# EAGLE design USB_LiPolyCharger_SingleCell (EAGLE 6.5.0)
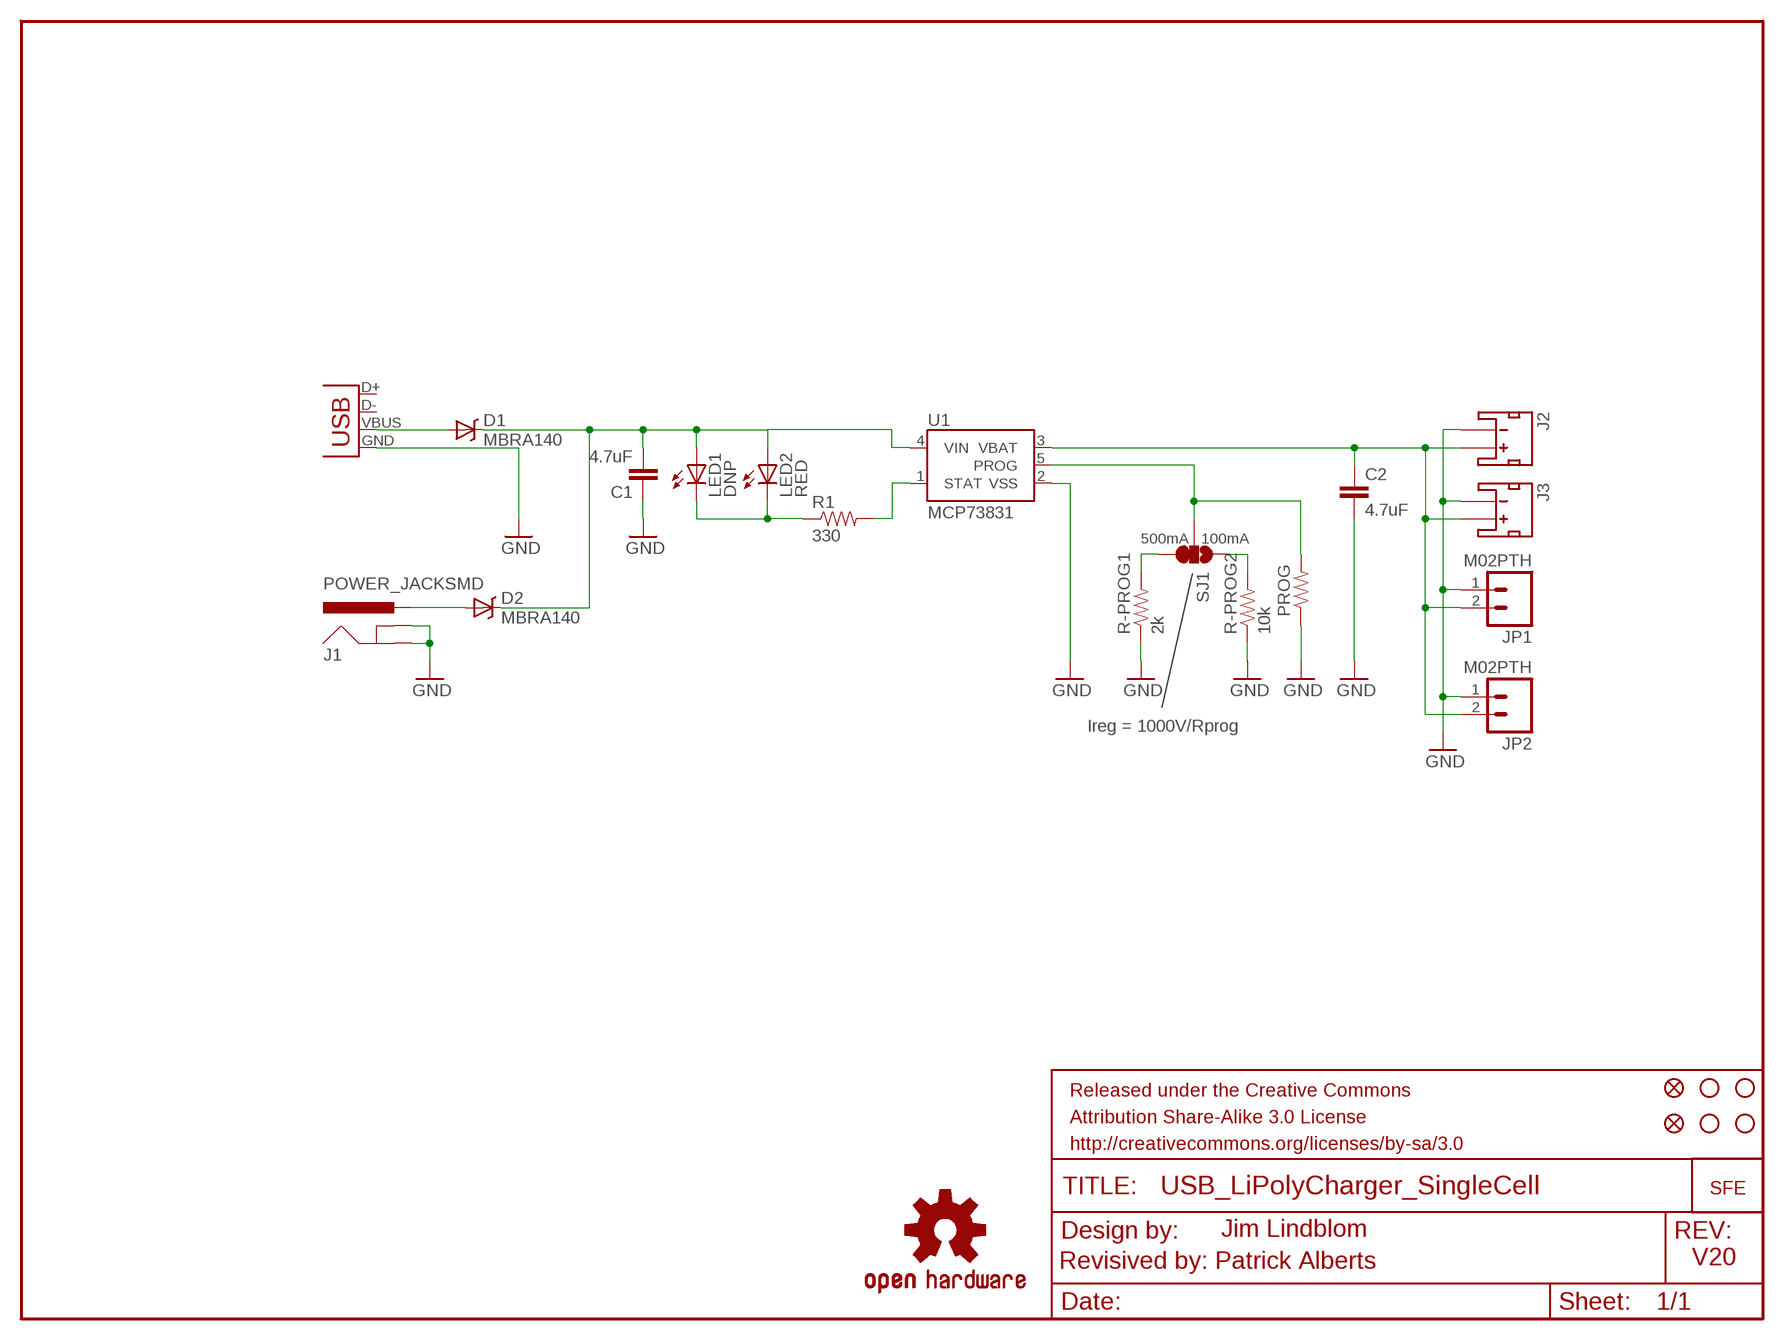
[diagram p0: schematic, sheet 1]

## Parts
C1  4.7uF  4.7UF-6.3V-10%(0603)0603  [0603-CAP]
C2  4.7uF  4.7UF-6.3V-10%(0603)0603  [0603-CAP]
D1  MBRA140  [SMA-DIODE]
D2  MBRA140  [SMA-DIODE]
FRAME1  FRAME-LETTER  [CREATIVE_COMMONS]
J1  POWER_JACKSMD  [POWER_JACK_SMD]
J2  JST_2MM_MALE  [JST-2-SMD]
J3  JST_2MM_MALE  [JST-2-SMD]
JP1  M02PTH  [1X02]
JP2  M02PTH  [1X02]
JP7  STAND-OFF  [STAND-OFF]
JP8  STAND-OFF  [STAND-OFF]
JP9  STAND-OFF  [STAND-OFF]
JP10  STAND-OFF  [STAND-OFF]
JP11  LOGO-SFENEW  [SFE-NEW-WEBLOGO]
JP12  FIDUCIAL1X2  [FIDUCIAL-1X2]
JP13  FIDUCIAL1X2  [FIDUCIAL-1X2]
LED1  DNP  LED3MM  [LED3MM]
LED2  RED  LED-RED0603  [LED-0603]
LOGO1  OSHW-LOGOS  [OSHW-LOGO-S]
PROG  RESISTORAXIAL-0.3  [AXIAL-0.3]
R1  330  330OHM1/10W1%(0603)  [0603-RES]
R-PROG1  2k  2.0KOHM1/10W5%(0603)  [0603-RES]
R-PROG2  10k  10KOHM1/10W1%(0603)0603  [0603-RES]
SJ1  SOLDERJUMPER_2WAYS  [SJ_3]
U1  MCP73831  [SOT23-5]
X1  USBSMD  [USB-MINIB]

## Nets
GND: C1.1 C2.2 J1.GND(GNDBREAK) J1.P$4(GND) J2.1(-) J3.1(-) JP1.1 JP2.1 PROG.P$1 R-PROG1.1 R-PROG2.1 U1.2(VSS) X1.GND
N$1: C1.2 D1.C D2.C LED1.A LED2.A U1.4(VIN)
N$2: R1.2 U1.1(STAT)
N$3: LED1.K(C) LED2.C R1.1
N$4: R-PROG1.2 SJ1.3
N$6: D1.A X1.VBUS
N$7: R-PROG2.2 SJ1.1
N$8: D2.A J1.VIN0(PWR)
N$10: C2.1 J2.2(+) J3.2(+) JP1.2 JP2.2 U1.3(VBAT)
PROG: PROG.P$2 SJ1.2 U1.5(PROG)
Unconnected: J2.NC1(PAD1) J2.NC2(PAD2) J3.NC1(PAD1) J3.NC2(PAD2) X1.D+ X1.D-

## Notes on the sheet
- 500mA | 100mA
- Ireg = 1000V/Rprog
- Jim Lindblom
- Revisived by: Patrick Alberts | V20

## Library data of the parts
C1 C2 = SparkFun-Capacitors:4.7UF-6.3V-10%(0603): CAP-08280; PROD_ID: CAP-08280
D1 D2 = SparkFun-DiscreteSemi:MBRA140: 40V, 1A Schottky rectifier SMA/DO-214AC package DIO-08053; PROD_ID: DIO-08053
FRAME1 = SparkFun-Aesthetics:FRAME-LETTER: Schematic Frame Standard 8.5x11 US Letter frame
J1 = SparkFun-Connectors:POWER_JACK: Power Jack This is the standard 5.5mm barrel jack for power. The PTH is the most common, proven, reliable, footprint. The Slot footprint only works if the mill layer is transmitted to the PCB fab house so be warned. Spark Fun Electronics SKU : PRT-00119 SMT: CONN-08106 Mating wall wart : TOL-00298 (and others); PROD_ID: CONN-08106; VALUE: 5.5x2.1mm Barrel
J2 J3 = SparkFun-Connectors:JST_2MM_MALE: Mates to single-cell LiPo batteries. CONN-08352; PROD_ID: CONN-08352
JP1 JP2 = SparkFun-Connectors:M02: Standard 2-pin 0.1" header. Use with - straight break away headers ( PRT-00116) - right angle break away headers (PRT-00553) - swiss pins (PRT-00743) - machine pins (PRT-00117) - female headers (PRT-00115) Molex polarized connector foot print use with: PRT-08233 with associated crimp pins and housings. 2.54_SCREWTERM for use with PRT-10571. 3.5mm Screw Terminal footprints for PRT-08084 5mm Screw Terminal footprints for use with PRT-08433
JP7-JP10 = SparkFun:STAND-OFF: Stand Off This is the mechanical footprint for a #4 phillips button head screw. Use the keepout ring to avoid running the screw head into surrounding components. SKU : PRT-00447
JP11 = SparkFun:LOGO-SFE: Spark Fun Electronics PCB Logo This is the standard Spark Fun Electronics PCB logo.
JP12 JP13 = SparkFun:FIDUCIAL: Fiducial Alignment Points Various fiducial points for machine vision alignment.
LED1 = SparkFun:LED: LEDs Standard schematic elements and footprints for 5mm, 3mm, 1206, and 0603 sized LEDs. 5mm - Spark Fun Electronics SKU : COM-00529 (and others)
LED2 = SparkFun-LED:LED-RED: Assorted Red LEDs LilyPad 1206- DIO-09912 1206- DIO-00809 0603- DIO-00819; PROD_ID: DIO-00819
LOGO1 = SparkFun-Aesthetics:OSHW-LOGO: Open Source Hardware Logo This logo indicates the piece of hardware it is found on incorporates a OSHW license and/or adheres to the definition of open source hardware found here: http://freedomdefined.org/OSHW
PROG = SparkFun-Resistors:RESISTOR: Resistor Basic schematic elements and footprints for 0603, 1206, and PTH resistors.
R1 = SparkFun-Resistors:330OHM1/10W1%(0603): RES-00818; PROD_ID: RES-00818
R-PROG1 = SparkFun-Resistors:2.0KOHM1/10W5%(0603): RES-08296; PROD_ID: RES-08296; VALUE: 2.0k
R-PROG2 = SparkFun-Resistors:10KOHM1/10W1%(0603): RES-00824; PROD_ID: RES-00824; VALUE: 10K
SJ1 = SparkFun:SOLDERJUMPER_2WAY: Solder Jumper 2 way solder jumper
U1 = SparkFun-PowerIC:MCP73831: Miniature single cell, fully integrated Li-Ion, Li-polymer charge management controller http://ww1.microchip.com/downloads/en/DeviceDoc/21984a.pdf IC-09995; PROD_ID: IC-09995
X1 = SparkFun-Connectors:USB: USB Connectors USB-B-PTH is fully proven SKU : PRT-00139/CONN-08278 USB-miniB is fully proven SKU : PRT-00587 USB-A-PCB is untested. USB-A-H is throughly reviewed, but untested. Spark Fun Electronics SKU : PRT-00437 USB-B-SMT is throughly reviewed, but untested. Needs silkscreen touching up. USB-A-S has not been used/tested USB-MB-H has not been used/tested USB-MICROB has been used. CONN-09505

## Board
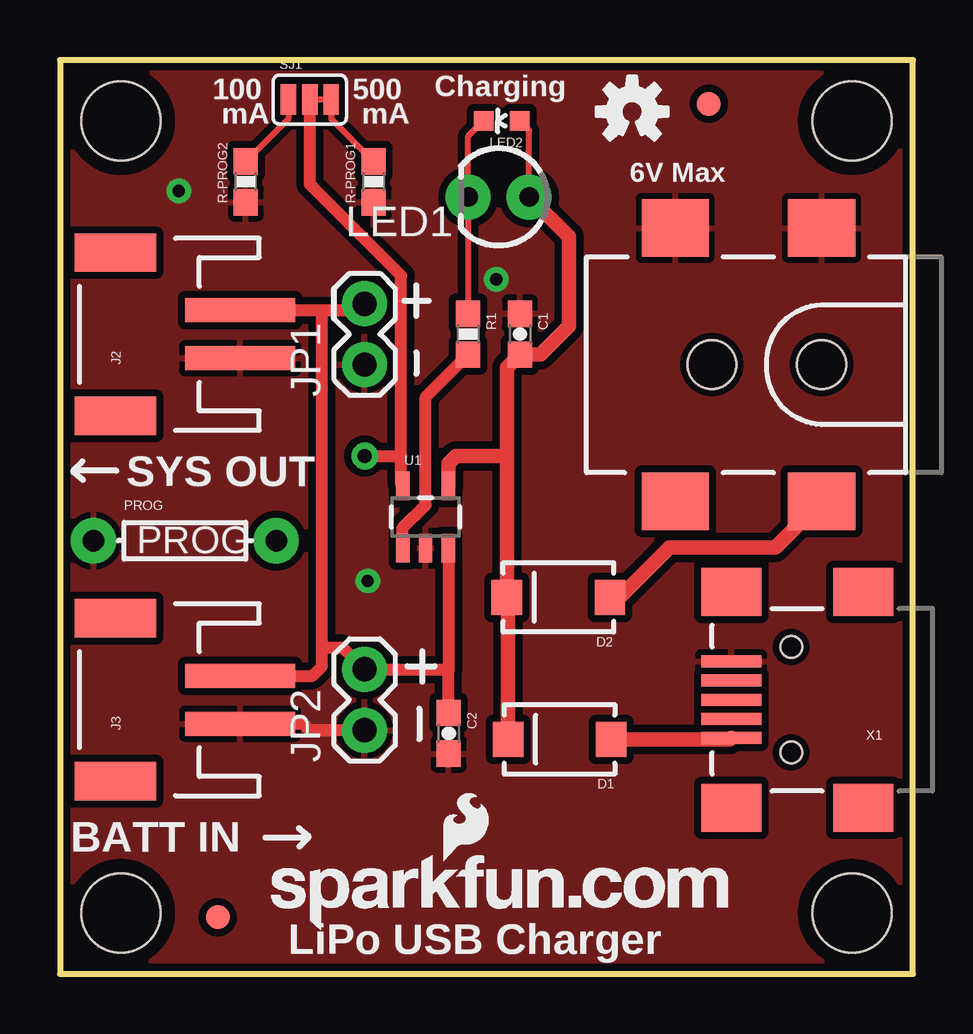
[diagram p1: board, top side]
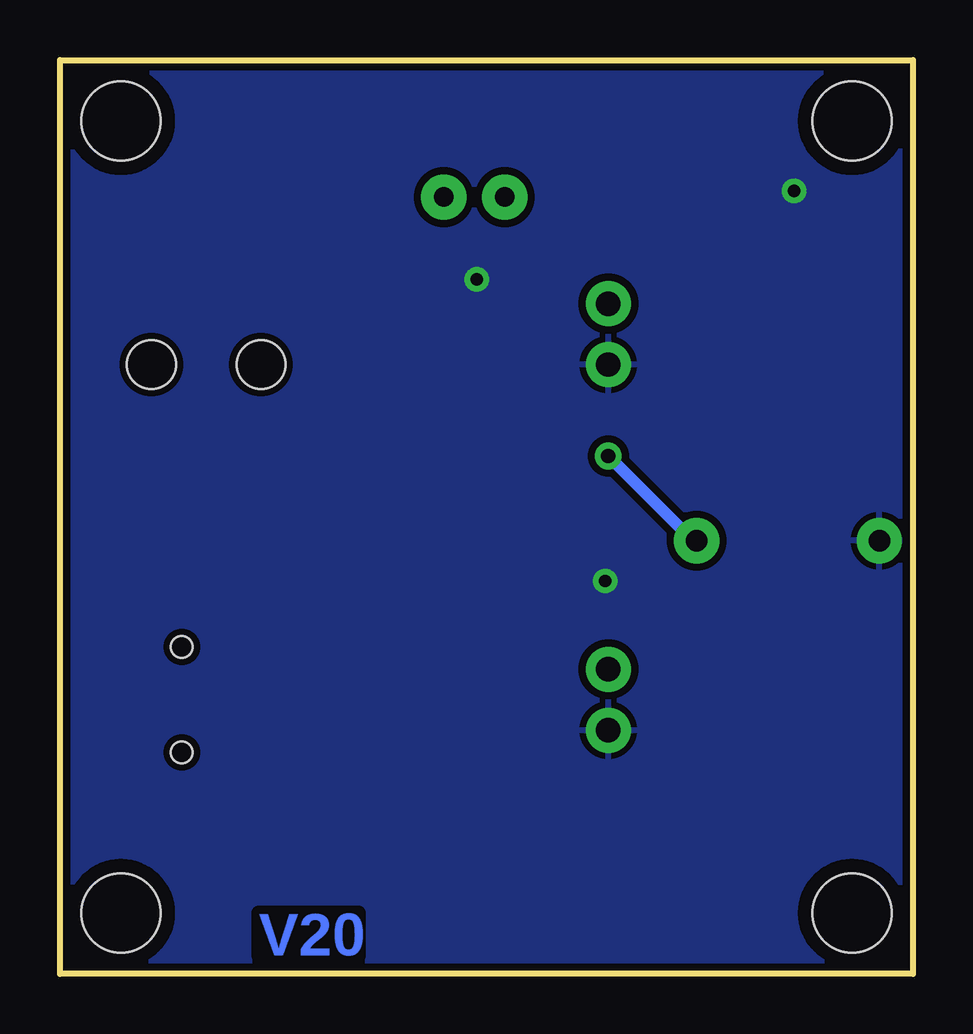
[diagram p2: board, bottom side, seen from below]

Size 35.56 x 38.1 mm. Coordinates in mm from the lower left corner, seen from the top.
Outline: 0,0 35.56,0 35.56,38.1 0,38.1 0,0
Copper layers (1*16): Top 0.035mm / dielectric 1.5mm / Bottom 0.035mm
Design rules "SparkFun *": minimum track width 8mil, minimum drill 20mil, track to track 8mil, track to pad 8mil, pad to pad 8mil, via to via 8mil, smd to smd 8mil, copper to edge 8mil, drill to drill 8mil, minimum pad ring 12mil, minimum via ring 10mil, stop-mask expansion 4mil, vias tented up to drill 20mil, thermal gap 10mil

### Footprints (pad centres in the part's own frame; a part is rotated, then mirrored left to right if it is on the bottom)
0603-CAP = smd 1.1 x 1: 1 -0.85,0; 2 0.85,0
SMA-DIODE = smd 1.27 x 1.47: A -2.15,0; C 2.15,0
POWER_JACK_SMD = smd 2.8 x 2.4: GND 0,-5.7; P$4 6.1,-5.7; VIN0 0,5.7; VIN1 6.1,5.7 | hole 2.032: 0,0; 4.572,0
JST-2-SMD = smd 1 x 4.6: 1 -1,-3.7; 2 1,-3.7 | smd 1.6 x 3.4: NC1 -3.4,1.5; NC2 3.4,1.5
1X02 = drill 1.016 pad 1.88: 1 0,0; 2 2.54,0
STAND-OFF = hole 3.302: 0,0
FIDUCIAL-1X2 = smd 1 x 1: 1 0,0
LED3MM = drill 0.813 pad 1.88: A -1.27,0; K 1.27,0
LED-0603 = smd 0.8 x 0.8: A 0,-0.75; C 0,0.75
AXIAL-0.3 = drill 0.9 pad 1.88: P$1 -3.81,0; P$2 3.81,0
0603-RES = smd 1.1 x 1: 1 -0.85,0; 2 0.85,0
SJ_3 = smd 0.635 x 1.27: 1 -0.889,0; 2 0,0; 3 0.889,0
SOT23-5 = smd 0.55 x 1.2: 1 -0.95,-1.3; 2 0,-1.3; 3 0.95,-1.3; 4 0.95,1.3; 5 -0.95,1.3
USB-MINIB = smd 2.5 x 0.5: D+ 2.5,0; D- 2.5,0.8; GND 2.5,-1.6; ID 2.5,-0.8; VBUS 2.5,1.6 | smd 2.5 x 2: MTN1 -3,4.5; MTN2 2.5,4.5; MTN3 -3,-4.5; MTN4 2.5,-4.5 | hole 0.9: 0,2.2; 0,-2.2

### Placement (x,y rotation side)
C1  19.18,26.67 270 top
C2  16.21,10.03 270 top
D1  20.83,9.78 180 top
D2  20.78,15.7 180 top
FRAME1  1.27,-11.43 0 top  (outside the outline)
J1  31.75,25.4 180 top
J2  3.81,26.67 90 top
J3  3.81,11.43 90 top
JP1  12.7,25.4 90 top
JP2  12.7,10.16 90 top
JP7  33.02,2.54 0 top
JP8  2.54,35.56 0 top
JP9  2.54,2.54 0 top
JP10  33.02,35.56 0 top
JP11  8.79,1.83 0 top
JP12  6.58,2.36 0 top
JP13  27.05,36.27 0 top
LED1  18.29,32.38 180 top
LED2  18.41,35.56 90 top
LOGO1  23.85,35.94 0 top
PROG  5.21,18.06 0 top
R1  17.02,26.67 270 top
R-PROG1  13.08,33.02 90 top
R-PROG2  7.75,33.02 90 top
SJ1  10.41,36.45 0 top
U1  15.24,19.05 0 top
X1  30.48,11.43 180 top

### Tracks (layer width: path | path; a pad name or v marks a point on that pad's centre or on a via)
GND  (via drill 0.51)
  Top 0.508: JP2.1 10.41,10.16 10.16,10.41 9.02,10.41 8.89,10.29
  other vias: 18.19,28.96 4.95,32.64 12.83,16.38
  pour Bottom (isolate 0.305): 0,0 0,38.1 35.56,38.1 35.56,0
  pour Top (isolate 0.305): 0,0 0,38.1 35.56,38.1 35.56,0
N$1
  Top 0.254: LED1.A 19.56,35.17 LED2.A
  Top 0.406: 18.92,25.82 C1.2
  Top 0.61: D1.C 18.68,15.65 D2.C 18.63,21.59 | 18.63,21.59 18.63,25.27 C1.2 20.03,25.82 21.21,27 21.21,30.73 LED1.A | U1.4 16.19,21.27 16.51,21.59 18.63,21.59
N$2
  Top 0.508: U1.1 14.29,18.61 15.24,19.56 15.24,24.04 R1.2
N$3
  Top 0.254: LED2.C 17.02,34.91 LED1.K R1.1
N$4
  Top 0.254: 11.34,36.41 SJ1.3 11.3,35.65 R-PROG1.2
N$5
  Top 0.254: 11.43,36.45 10.29,36.45
N$6
  Top 0.61: D1.A 27.93,9.78 X1.VBUS
N$7
  Top 0.254: SJ1.1 9.53,35.65 R-PROG2.2
N$8
  Top 0.61: D2.A 23.32,15.7 25.4,17.78 29.83,17.78 J1.VIN0
N$10
  Top 0.508: J2.2 10.92,27.67 | 10.92,27.67 12.43,27.67 JP1.2 | J3.2 10.53,12.43 10.92,12.83 10.92,13.59 | 10.92,13.59 10.92,27.67 | 10.92,13.59 11.81,13.59 JP2.2 16.19,12.7 | U1.3 16.19,12.7 | C2.1 16.21,12.69 16.19,12.7
PROG  (via drill 0.6)
  Top 0.508: SJ1.2 10.41,32.92 10.49,32.84 10.87,32.46 14.22,29.11 14.22,21.59 | U1.5 14.22,20.42 14.22,21.59 | v12.7,21.59 14.22,21.59
  Bottom 0.508: PROG.P$2 9.17,18.06 v12.7,21.59

### Text on the board
Bottom: V20
tPlace: Charging | 100 | 500 | mA | mA | 6V Max | SYS OUT | PROG | BATT IN | LiPo USB Charger
tDocu: Jim Lidblom | Revised by: Patrick Alberts